# EasyEDA Pro project GPU USB PWM Fan Controller.epro

# Schematic Schematic1_1
Board Name: Board1; Create Date: 2026-03-28; Page Name: P1; Project Name: 多路温控控制PWM风扇; Schematic Name: Schematic1; Update Date: 2026-03-28; Company: 嘉立创EDA; Page Size: A4; Version: V1.0
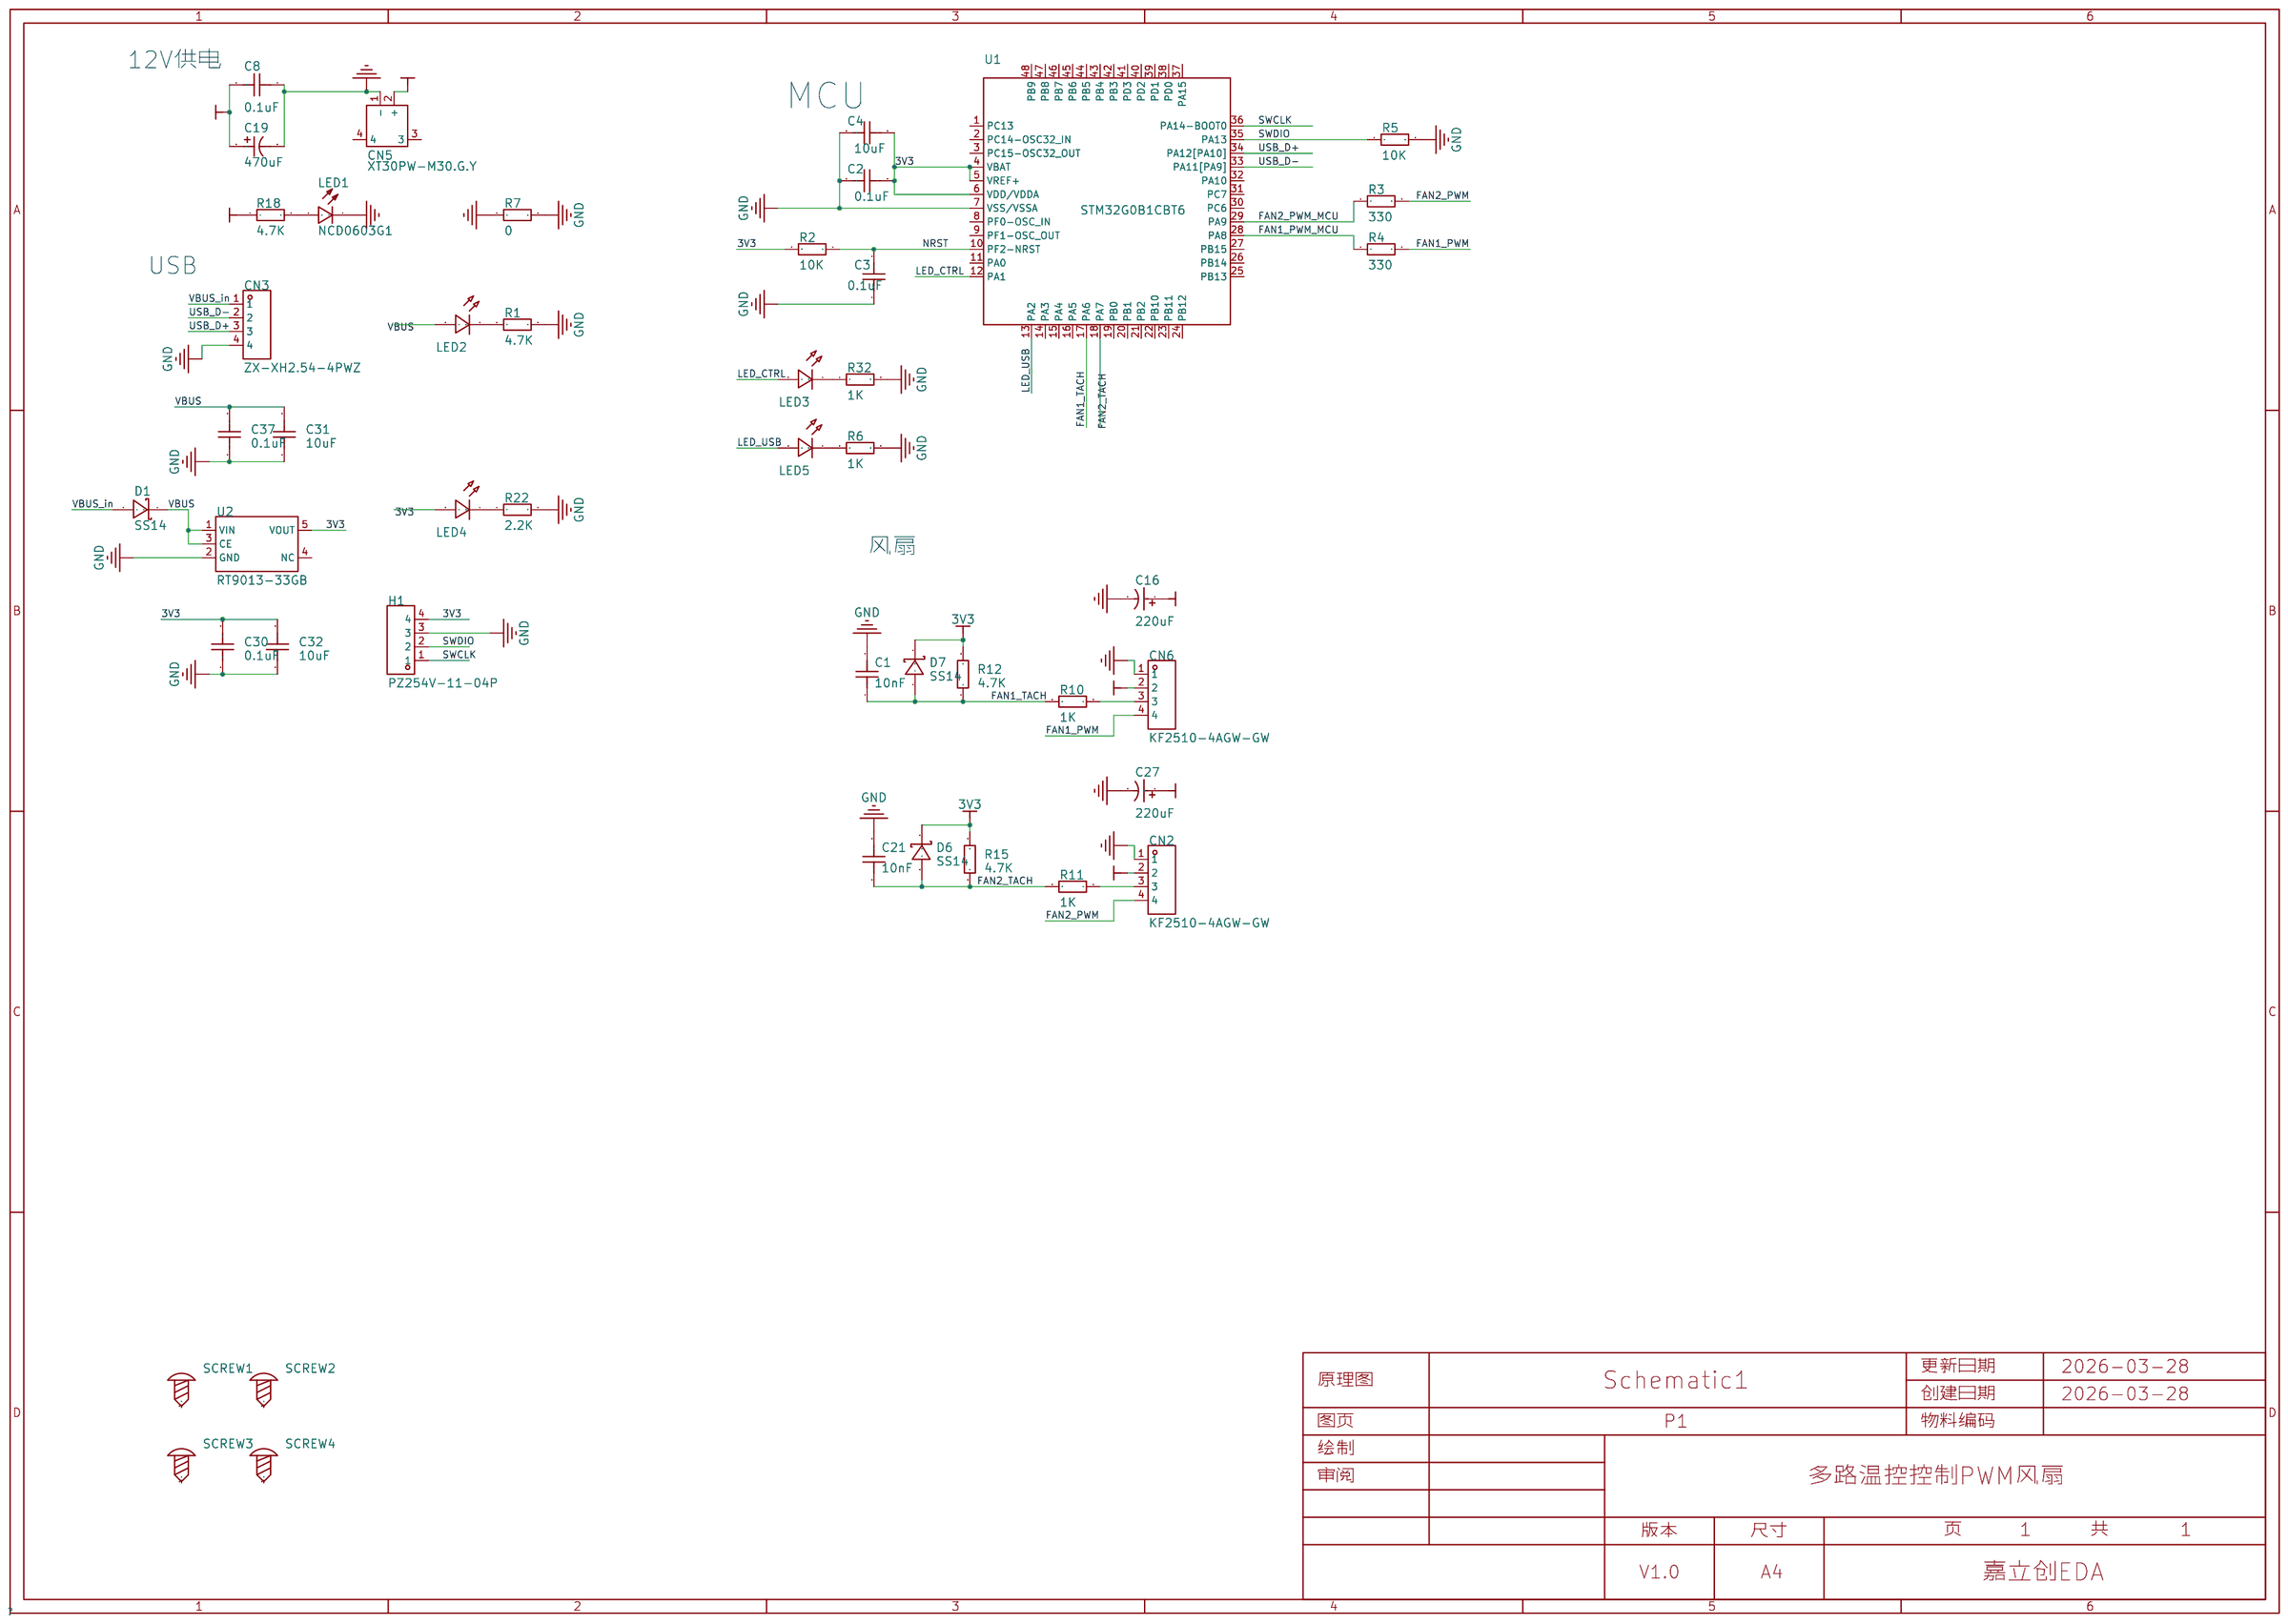
[diagram p0: schematic sheet]

## Parts
C1  10nF  [C0603]
C2  0.1uF  [C0603]
C3  0.1uF  [C0603]
C4  10uF  [C0603]
C8  0.1uF  [C0603]
C16  220uF  [CAP-SMD_BD6.3-L6.6-W6.6-FD]
C19  470uF  [CAP-SMD_BD6.3-L6.6-W6.6-LS7.6-FD]
C21  10nF  [C0603]
C27  220uF  [CAP-SMD_BD6.3-L6.6-W6.6-FD]
C30  0.1uF  [C0603]
C31  10uF  [C0603]
C32  10uF  [C0603]
C37  0.1uF  [C0603]
CN2  KF2510-4AGW-GW  [CONN-TH_4P-P2.54_CAX_KF2510-4AGW-GW]
CN3  ZX-XH2.54-4PWZ  [CONN-TH_4P-P2.50_ZX-XH2.54-4PWZ]
CN5  XT30PW-M30.G.Y  [CONN-TH_XT30PW-M]
CN6  KF2510-4AGW-GW  [CONN-TH_4P-P2.54_CAX_KF2510-4AGW-GW]
D1  SS14  [SMA_L4.3-W2.6-LS5.2-RD]
D6  SS14  [SMA_L4.3-W2.6-LS5.2-RD]
D7  SS14  [SMA_L4.3-W2.6-LS5.2-RD]
H1  PZ254V-11-04P  [HDR-TH_4P-P2.54-V-M]
LED1  NCD0603G1  [LED0603-RD_1]
LED2  -  [LED_0603]
LED3  -  [LED_0603]
LED4  -  [LED_0603]
LED5  -  [LED_0603]
R1  4.7K  [R0603]
R2  10K  [R0603]
R3  330  [R0603]
R4  330  [R0603]
R5  10K  [R0603]
R6  1K  [R0603]
R7  0  [R0603]
R10  1K  [R0603]
R11  1K  [R0603]
R12  4.7K  [R0603]
R15  4.7K  [R0603]
R18  4.7K  [R0603]
R22  2.2K  [R0603]
R32  1K  [R0603]
SCREW1  -  [M3螺丝]
SCREW2  -  [M3螺丝]
SCREW3  -  [M3螺丝]
SCREW4  -  [M3螺丝]
U1  STM32G0B1CBT6  [LQFP-48_L7.0-W7.0-P0.50-LS9.0-BL]
U2  RT9013-33GB  [SOT-23-5_L2.9-W1.6-P0.95-LS2.8-BR]

## Library data of the parts
C1-C4 C8 C21 C30-C32 C37 = CAP_0603: Supplier Footprint: 0603
C16 C27 = RVT1A221M0605_C72494: 容值:220uF;精度:±20%;额定电压:10V;纹波电流:90mA@120Hz;等效串联电阻(ESR):-;; LCSC Part Name: 220uF ±20% 10V; Supplier Part: C72494; Manufacturer: ROQANG(容强); Manufacturer Part: RVT1A221M0605; Supplier Footprint: SMD,D6.3xL5.4mm; JLCPCB Part Class: Extended Part; Datasheet: https://atta.szlcsc.com/upload/public/pdf/source/20170325/1490427950282.pdf; Supplier: LCSC; Tolerance: ±20%; Voltage Rating: 10V; Ripple Current: 90mA@120Hz; Diameter: 6.3mm; Height - Seated (Max): 5.4mm; Lifetime: 2000hrs@105℃; Operating Temperature: -40℃~+105℃
C19 = RVT470UF10V67RV0159: 容值:470uF;精度:±20%;额定电压:10V;等效串联电阻(ESR):-;; LCSC Part Name: 470uF ±20% 10V; Supplier Part: C2858856; Manufacturer: KNSCHA(科尼盛); Supplier Footprint: SMD,D6.3xL7.7mm; JLCPCB Part Class: Extended Part; Datasheet: https://item.szlcsc.com/datasheet/RVT470UF10V67RV0159/3062332.html; Supplier: LCSC; Tolerance: ±20%; Voltage Rating: 10V; Diameter: 6.3mm; Height - Seated (Max): 7.7mm; Lifetime: 2000hrs@105℃; Operating Temperature: -55℃~+105℃
CN2 CN6 = KF2510-4AGW-GW: 插针结构:1x4P;间距:2.54mm;安装方式:弯插;参考系列:-;总PIN数:4P;排数:1;每排PIN数:4;行距:-;额定电流:3A;触头材质:黄铜;工作温度:-25℃~+85℃;; LCSC Part Name: 1x4P 间距:2.54mm 弯插; Supplier Part: C722747; Manufacturer: CAX(创都); Supplier Footprint: 弯插,P=2.54mm; JLCPCB Part Class: Extended Part; Datasheet: https://item.szlcsc.com/datasheet/KF2510-4AGW-GW/766954.html; Supplier: LCSC; Pins Structure: 1x4P; Pitch: 2.54mm; Mounting Type: 弯插; Number of Pins: 4P; Number of Rows: 1; Number of PINs Per Row: 4; Current Rating: 3A; Contact Material: 黄铜; Operating Temperature: -25℃~+85℃; Voltage Rating: 250V; Plastic Material: PA66; Color: 米色; Z-Height of the Board: 5.8mm; X-Length of Bottom Edge on Board (Spacing Line): 10.16mm
CN3 = ZX-XH2.54-4PWZ: 插针结构:1x4P;间距:2.5mm;安装方式:弯插;参考系列:XH;总PIN数:4P;排数:1;每排PIN数:4;行距:-;额定电流:3A;触头材质:黄铜;触头镀层:锡;工作温度:-25℃~+85℃;; LCSC Part Name: 1x4P 间距:2.5mm 弯插 系列:XH; Supplier Part: C7429643; Manufacturer: Megastar(兆星); Supplier Footprint: 弯插,P=2.5mm; JLCPCB Part Class: Extended Part; Datasheet: https://item.szlcsc.com/datasheet/ZX-XH2.54-4PWZ/8427560.html; Supplier: LCSC; Pins Structure: 1x4P; Pitch: 2.5mm; Mounting Type: 弯插; Reference Series: XH; Number of Pins: 4P; Number of Rows: 1; Number of PINs Per Row: 4; Current Rating: 3A; Contact Material: 黄铜; Contact Plating: 锡; Operating Temperature: -25℃~+85℃; Voltage Rating: 250V; Plastic Material: PA66; Flame Retardant Rating: UL94V-0; Color: 白色; Z-Height of the Board: 5.9mm; X-Length of Bottom Edge on Board (Spacing Line): 12.5mm; Y-Width of Bottom Edge on Board: 7.32mm
CN5 = XT30PW-M30.G.Y: Socket,DCsupply,XT30,male,PIN:2; LCSC Part Name: AMASS(艾迈斯)航模插头电调机插座锂电池连接器 PCB板卧式 公头XT30PW-M30.G.Y; Supplier Part: C431092; Manufacturer: AMASS(艾迈斯); JLCPCB Part Class: Extended Part; Datasheet: https://item.szlcsc.com/datasheet/XT30PW-M30.G.Y/426930.html; Supplier: LCSC; Rated current: 15A; Rated voltage: 500VDC; Connector type: 航模插头; Wire gauge: 16/18/20AWG; contact resistance: 1.2mΩ; Size/Specification: 2pin; interface form: 公头
D1 D6 D7 = SS14_C83852: 正向压降(Vf):500mV@1A;直流反向耐压(Vr):40V;整流电流:1A;; LCSC Part Name: 电压:40V 电流:1A; Supplier Part: C83852; Manufacturer: onsemi(安森美); Supplier Footprint: SMA(DO-214AC); JLCPCB Part Class: Extended Part; Datasheet: https://item.szlcsc.com/datasheet/SS14/85019.html; Supplier: LCSC; Voltage - Forward(Vf@If): 500mV@1A; Voltage - DC Reverse(Vr): 40V; Current - Rectified: 1A; Reverse Leakage Current (Ir): 200uA@40V; Operating Junction Temperature Range: -65℃~+125℃; Non-Repetitive Peak Forward Surge Current: 40A
H1 = PZ254V-11-04P: 插针结构:1x4P;间距:2.54mm;行距:-;圆针/方针:方针;安装方式:直插;排数:单排;总PIN位数:4P;额定电流:3A;额定电压:250V;配合针长度:6mm;塑高:2.5mm;端接针长度:3mm;触头材质:-;工作温度:-40℃~+105℃;颜色:黑色;; LCSC Part Name: 1x4P 间距:2.54mm 方针 直插; Supplier Part: C2691448; Manufacturer: XFCN(兴飞); Supplier Footprint: 插件,P=2.54mm; JLCPCB Part Class: Extended Part; Datasheet: https://item.szlcsc.com/datasheet/PZ254V-11-04P/2801085.html; Supplier: LCSC; Pin Structure: 1x4P; Pitch: 2.54mm; Circluar Pins/Square Pins: 方针; Mounting Type: 直插; Number of Rows: 单排; Number of Pins: 4P; Current Rating: 3A; Voltage Rating (Max): 250V; Length of Mating Pin: 6mm; Insulation Height: 2.5mm; Length of End Connection Pin: 3mm; Operating Temperature: -40℃~+105℃; Color: 黑色
LED1 = NCD0603G1: 灯头类型:-;发光颜色:翠绿色;正向压降(Vf):2.6V~3.6V;功率:72mW;正向电流:20mA;波长:515nm~530nm;二极管配置:独立二极管;透镜颜色:-;色温:-;发光强度:900mcd;发光角度:130°;载带方式:-;工作温度:-30℃~+85℃;; LCSC Part Name: 片式发光二极管; Supplier Part: C84267; Manufacturer: 国星光电; Supplier Footprint: 0603; JLCPCB Part Class: Extended Part; Datasheet: https://item.szlcsc.com/datasheet/NCD0603G1/85436.html; Supplier: LCSC; Illumination Color: 翠绿色; Voltage - Forward(Vf): 2.6V~3.6V; Power(Watts): 72mW; Forward Current: 20mA; Wavelength - Dominant: 515nm~530nm; Peak Wavelength: 520nm; Diode Configuration: 独立二极管; Luminous Intensity: 900mcd; Viewing Angle: 130°; Operating Temperature: -30℃~+85℃
LED2-LED5 = LED_0603-R: Supplier Footprint: 0603
R1-R7 R10-R12 R15 R18 R22 R32 = Res_0603: Supplier Footprint: 0603
SCREW1-SCREW4 = M3螺丝: Supplier Footprint: 插件
U1 = STM32G0B1CBT6: CPU内核:ARM-M系列;应用领域:-;; LCSC Part Name: 主流Arm Cortex-M0+ 32位MCU，最高128KB闪存，144KB内存，6个USART，定时器，ADC，DAC，通信接口，1.7-3.6V; Supplier Part: C2847904; Manufacturer: ST(意法半导体); Supplier Footprint: LQFP-48(7x7); JLCPCB Part Class: Extended Part; Datasheet: https://item.szlcsc.com/datasheet/STM32G0B1CBT6/3045330.html; Supplier: LCSC; CPU Core: ARM-M系列
U2 = RT9013-33GB_C19268157: Supplier Part: C19268157; Manufacturer: TECH PUBLIC(台舟); Supplier Footprint: SOT-23-5; JLCPCB Part Class: 扩展库; Datasheet: https://atta.szlcsc.com/upload/public/pdf/source/20231201/9D78CA17020D67EC103F1AC7C29CF260.pdf; Supplier: LCSC

## Nets
3V3: C2.1 C4.1 C30.2 C32.2 D6.1(K) D7.1(K) H1.4 LED4.2(A) R2.2 R12.2 R15.2 U1.4(VBAT) U1.5(VREF+) U1.6(VDD/VDDA) U2.5(VOUT)
12V: C8.2 C16.1 C19.1 C27.1 CN2.2 CN5.2(+) CN6.2 R18.1
GND: C1.2 C2.2 C3.1 C4.2 C21.2 C30.1 C31.1 C32.1 C37.1 CN3.4 H1.3 R1.2 R5.2 R6.2 R7.2 R22.2 R32.2 U1.7(VSS/VSSA) U2.2(GND)
PGND: C8.1 C16.2 C19.2 C27.2 CN2.1 CN5.1(-) CN6.1 LED1.1(K) R7.1
VBUS: C31.2 C37.2 D1.1(K) LED2.2(A) U2.1(VIN) U2.3(CE)
VBUS_in: CN3.1 D1.2(A)
FAN1_PWM: CN6.4 R4.2
FAN1_PWM_MCU: R4.1 U1.28(PA8)
FAN1_TACH: C1.1 D7.2(A) R10.2 R12.1 U1.17(PA6)
FAN2_PWM: CN2.4 R3.2
FAN2_PWM_MCU: R3.1 U1.29(PA9)
FAN2_TACH: C21.1 D6.2(A) R11.2 R15.1 U1.18(PA7)
LED_CTRL: LED3.2(A) U1.12(PA1)
LED_USB: LED5.2(A) U1.13(PA2)
NRST: C3.2 R2.1 U1.10(PF2-NRST)
SWCLK: H1.1 U1.36(PA14-BOOT0)
SWDIO: H1.2 R5.1 U1.35(PA13)
USB_D+: CN3.3 U1.34(PA12[PA10])
USB_D-: CN3.2 U1.33(PA11[PA9])
$1N259: CN6.3 R10.1
$1N269: CN2.3 R11.1
$1N393: LED1.2(A) R18.2
$1N403: LED4.1(C) R22.1
$1N469: LED2.1(C) R1.1
$1N527: LED3.1(C) R32.1
$1N556: LED5.1(C) R6.1

Not connected (* = marked no-connect by the designer): CN5 3 4; SCREW1 1; SCREW2 1; SCREW3 1; SCREW4 1; U1 1(PC13) 2(PC14-OSC32_IN) 3(PC15-OSC32_OUT) 8(PF0-OSC_IN) 9(PF1-OSC_OUT) 11(PA0) 14(PA3) 15(PA4) 16(PA5) 19(PB0) 20(PB1) 21(PB2) 22(PB10) 23(PB11) 24(PB12) 25(PB13) 26(PB14) 27(PB15) 30(PC6) 31(PC7) 32(PA10) 37(PA15) 38(PD0) 39(PD1) 40(PD2) 41(PD3) 42(PB3) 43(PB4) 44(PB5) 45(PB6) 46(PB7) 47(PB8) 48(PB9); U2 4(NC)

## Notes on the sheet
- 12V供电
- MCU
- USB
- 风扇

# Board PCB1_1
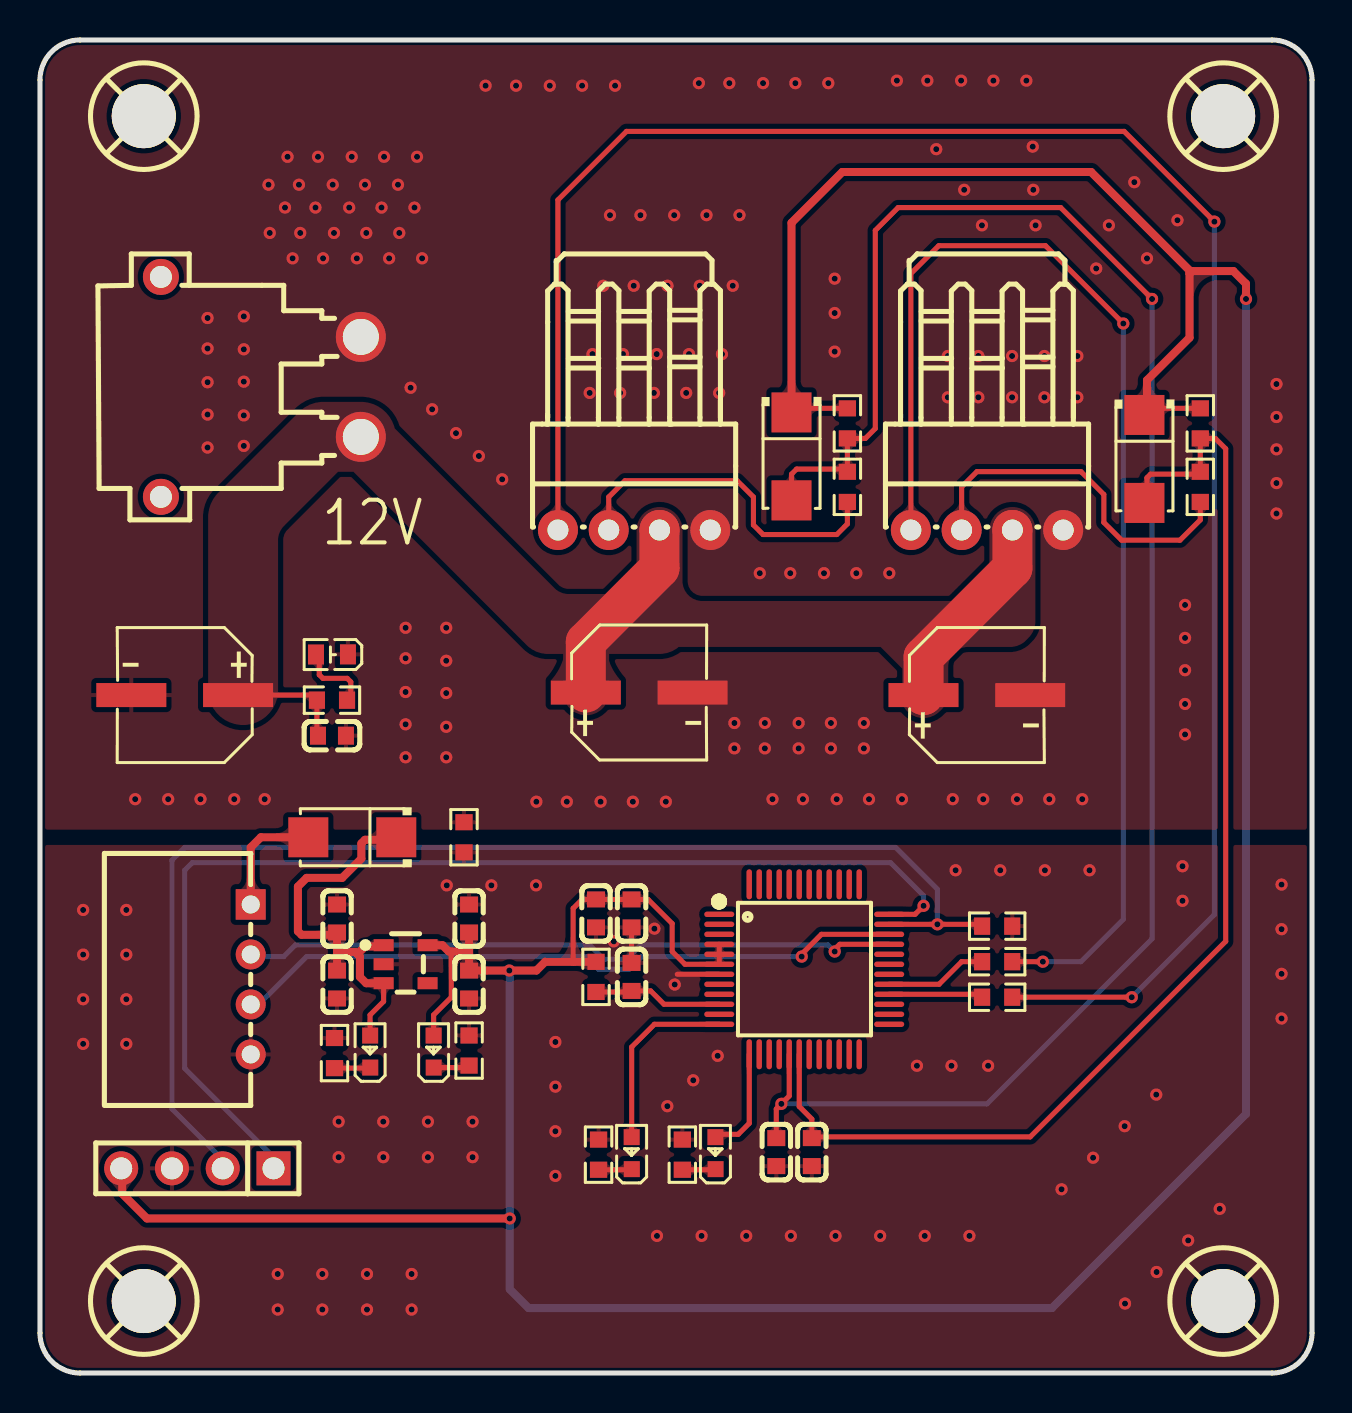
[diagram p1: board, top side]
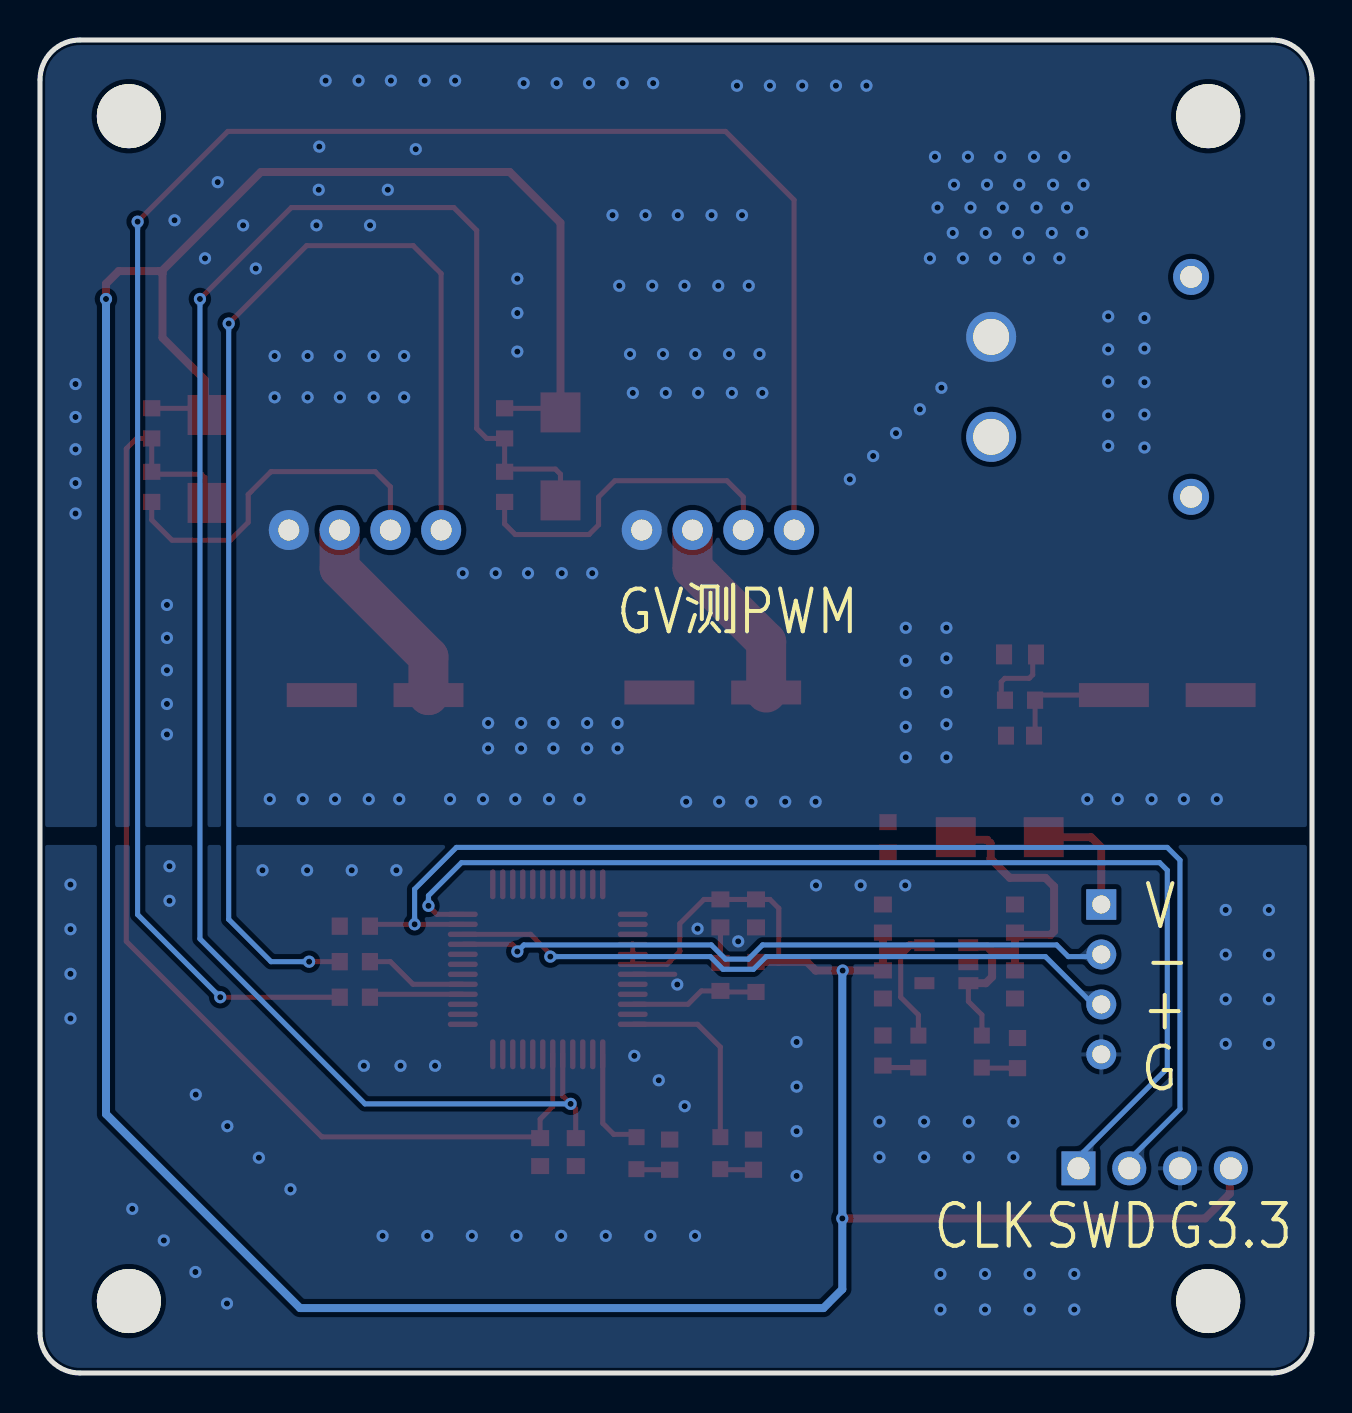
[diagram p2: board, bottom side, seen from below]

Outline 63.63 x 66.67 mm; copper layers: Top Layer, Inner1, Inner2, Bottom Layer. Coordinates in mm from the lower left corner of the outline.
Outline path: 0,64.67 0,2 arc(0.59,0.59) 2,0 61.63,0 arc(63.04,0.59) 63.63,2 63.63,64.67 arc(63.04,66.09) 61.63,66.67 2,66.67 arc(0.59,66.09) 0,64.67
Stack: Top Layer 0.035mm Outer layer thickness 1oz / Dielectric1 0.2104mm 7628 RC49% 8.6mil / Inner1 0.0152mm Inner layer thickness / Dielectric2 1.065mm 1.1mm H/HOZ Copper / Inner2 0.0152mm Inner layer thickness / Dielectric3 0.2104mm 7628 RC49% 8.6mil / Bottom Layer 0.035mm Outer layer thickness 1oz

## Design rules (mm)
spacing copperThickness1oz (default): track to track 0.102, other pairs 0.152 to 0.3
spacing copperThickness2oz: track to track 0.203, other pairs 0.152 to 0.3
track width copperThickness1oz (default): min 0.127, default 0.254, max 2.54
track width copperThickness2oz: min 0.203, default 0.254, max 2.54
differential pair differentialPair (default): width min 0.127, default 0.254, max 2.54; gap min 0.152, default 0.152
net PGND uses copperRegion
net GND uses copperRegion
net 12V uses copperRegion

## Placement (name value [footprint] x y rotation side)
C1  10nF  [C0603]  36.83 11.05 270 top
C2  0.1uF  [C0603]  29.59 22.99 270 top
C3  0.1uF  [C0603]  29.59 19.81 270 top
C4  10uF  [C0603]  27.81 22.99 270 top
C8  0.1uF  [C0603]  14.6 31.88 180 top
C16  220uF  [CAP-SMD_BD6.3-L6.6-W6.6-FD]  46.86 33.91 0 top
C19  470uF  [CAP-SMD_BD6.3-L6.6-W6.6-LS7.6-FD]  7.24 33.91 180 top
C21  10nF  [C0603]  38.61 11.05 270 top
C27  220uF  [CAP-SMD_BD6.3-L6.6-W6.6-FD]  29.97 34.04 0 top
C30  0.1uF  [C0603]  21.46 19.43 90 top
C31  10uF  [C0603]  14.86 19.43 90 top
C32  10uF  [C0603]  21.46 22.73 270 top
C37  0.1uF  [C0603]  14.86 22.73 270 top
CN2  KF2510-4AGW-GW  [CONN-TH_4P-P2.54_CAX_KF2510-4AGW-GW]  47.37 42.16 180 top
CN3  ZX-XH2.54-4PWZ  [CONN-TH_4P-P2.50_ZX-XH2.54-4PWZ]  10.54 19.68 270 top
CN5  XT30PW-M30.G.Y  [CONN-TH_XT30PW-M]  11.05 49.32 270 top
CN6  KF2510-4AGW-GW  [CONN-TH_4P-P2.54_CAX_KF2510-4AGW-GW]  29.72 42.16 180 top
D1  SS14  [SMA_L4.3-W2.6-LS5.2-RD]  15.62 26.8 180 top
D6  SS14  [SMA_L4.3-W2.6-LS5.2-RD]  55.25 45.72 270 top
D7  SS14  [SMA_L4.3-W2.6-LS5.2-RD]  37.59 45.85 270 top
H1  PZ254V-11-04P  [HDR-TH_4P-P2.54-V-M]  7.87 10.24 180 top
LED1  NCD0603G1  [LED0603-RD_1]  14.6 35.94 180 top
LED2  -  [LED_0603]  16.51 16.13 90 top
LED3  -  [LED_0603]  29.59 11.05 90 top
LED4  -  [LED_0603]  19.69 16.13 90 top
LED5  -  [LED_0603]  33.78 11.05 90 top
R1  4.7K  [R0603]  14.73 16 90 top
R2  10K  [R0603]  27.81 19.81 90 top
R3  330  [R0603]  47.88 20.57 0 top
R4  330  [R0603]  47.88 18.8 0 top
R5  10K  [R0603]  47.88 22.35 0 top
R6  1K  [R0603]  32.13 10.92 90 top
R7  0  [R0603]  21.21 26.8 270 top
R10  1K  [R0603]  40.39 44.32 90 top
R11  1K  [R0603]  58.04 44.32 90 top
R12  4.7K  [R0603]  40.39 47.5 90 top
R15  4.7K  [R0603]  58.04 47.5 90 top
R18  4.7K  [R0603]  14.6 33.66 0 top
R22  2.2K  [R0603]  21.46 16.13 90 top
R32  1K  [R0603]  27.94 10.92 90 top
SCREW1  -  [M3螺丝]  5.19 62.86 0 top
SCREW2  -  [M3螺丝]  59.18 62.86 0 top
SCREW3  -  [M3螺丝]  59.18 3.6 0 top
SCREW4  -  [M3螺丝]  5.19 3.6 0 top
U1  STM32G0B1CBT6  [LQFP-48_L7.0-W7.0-P0.50-LS9.0-BL]  38.23 20.19 270 top
U2  RT9013-33GB  [SOT-23-5_L2.9-W1.6-P0.95-LS2.8-BR]  18.29 20.45 180 top

## Footprints (pads in the part's own frame, mm; a bottom-side part is the same pattern mirrored in y, then rotated)
C0603
  rect 0.8x0.9 smd: 1(-0.7,0) 2(0.7,0)
CAP-SMD_BD6.3-L6.6-W6.6-FD
  rect 3.5x1.2 smd: 1(-2.67,0) 2(2.67,0)
CAP-SMD_BD6.3-L6.6-W6.6-LS7.6-FD
  rect 3.5x1.2 smd: 1(-2.67,0) 2(2.67,0)
CONN-TH_4P-P2.50_ZX-XH2.54-4PWZ
  rect 1.524x1.5 hole 0.9: 1(-3.75,0)
  round 1.5 hole 0.9: 2(-1.25,0) 3(1.25,0) 4(3.75,0)
CONN-TH_4P-P2.54_CAX_KF2510-4AGW-GW
  round 2 hole 1.05: 1(-3.81,0) 2(-1.27,0) 3(1.27,0) 4(3.81,0)
CONN-TH_XT30PW-M
  round 2.5 hole 1.8: 1(-2.5,5) 2(2.5,5)
  round 1.8 hole 1.1: 3(5.5,-5) 4(-5.5,-5)
HDR-TH_4P-P2.54-V-M
  rect 1.7x1.7 hole 1.1: 1(-3.81,0)
  round 1.7 hole 1.1: 2(-1.27,0) 3(1.27,0) 4(3.81,0)
LED0603-RD_1
  rect 0.8x1 smd: 1(-0.799,-0.004) 2(0.799,0.004)
LED_0603
  rect 0.8x0.8 smd: 1(-0.851,-0.01) 2(0.75,-0.005)
LQFP-48_L7.0-W7.0-P0.50-LS9.0-BL
  oval 0.27x1.5 smd: 1(-2.75,-4.25) 2(-2.25,-4.25) 3(-1.75,-4.25) 4(-1.25,-4.25) 5(-0.75,-4.25) 6(-0.25,-4.25) 7(0.25,-4.25) 8(0.75,-4.25) 9(1.25,-4.25) 10(1.75,-4.25) 11(2.25,-4.25) 12(2.75,-4.25) 25(2.75,4.25) 26(2.25,4.25) 27(1.75,4.25) 28(1.25,4.25) 29(0.75,4.25) 30(0.25,4.25) 31(-0.25,4.25) 32(-0.75,4.25) 33(-1.25,4.25) 34(-1.75,4.25) 35(-2.25,4.25) 36(-2.75,4.25)
  oval 1.5x0.27 smd: 13(4.25,-2.75) 14(4.25,-2.25) 15(4.25,-1.75) 16(4.25,-1.25) 17(4.25,-0.75) 18(4.25,-0.25) 19(4.25,0.25) 20(4.25,0.75) 21(4.25,1.25) 22(4.25,1.75) 23(4.25,2.25) 24(4.25,2.75) 37(-4.25,2.75) 38(-4.25,2.25) 39(-4.25,1.75) 40(-4.25,1.25) 41(-4.25,0.75) 42(-4.25,0.25) 43(-4.25,-0.25) 44(-4.25,-0.75) 45(-4.25,-1.25) 46(-4.25,-1.75) 47(-4.25,-2.25) 48(-4.25,-2.75)
M3螺丝
  round 3.2 hole 3.2: 1(0,0)
R0603
  rect 0.806x0.864 smd: 1(-0.753,0) 2(0.753,0)
SMA_L4.3-W2.6-LS5.2-RD
  rect 2x2 smd: 1(-2.2,0) 2(2.2,0)
SOT-23-5_L2.9-W1.6-P0.95-LS2.8-BR
  rect 1x0.6 smd: 1(1.1,-0.95) 2(1.1,0) 3(1.1,0.95) 4(-1.1,0.95) 5(-1.1,-0.95)

## Nets
As in the schematic.

Pads without a net: CN5 3 4; SCREW1 1; SCREW2 1; SCREW3 1; SCREW4 1; U1 1 2 3 8 9 11 14 15 16 19 20 21 22 23 24 25 26 27 30 31 32 37 38 39 40 41 42 43 44 45 46 47 48; U2 4

## Via types
v1: diameter 0.61, hole 0.305, Top Layer to Bottom Layer, 233 vias

## Routing (per net, layer and track width the routed paths; a pad name or vN(x,y) marks a point on that pad's centre or on a via; arc(x,y) is an arc through that point)
3V3: length 198
  Top Layer w0.254: 20.57,21.08 20.57,21.07 20.57,18.8 19.69,17.91 LED4.2 ; 26.68,20.57 26.67,20.57 26.67,23.24 27.12,23.69 C2.1 30.41,23.69 31.62,22.48 31.62,21.08 32.26,20.44 U1.6 U1.5 U1.4 ; R12.2 37.8,48.25 D7.1 ; R15.2 55.58,48.25 D6.1
  Top Layer w0.4: v1(60.32,53.72) 60.32,54.48 59.69,55.12 57.63,55.12 57.5,54.99 ; C32.2 C30.2 v1(23.48,20.13) 24.83,20.13 25.26,20.57 R2.2 ; D7.1 37.59,57.53 40.13,60.07 52.58,60.07 57.5,55.15 57.5,54.99 ; 21.34,21.08 20.45,21.08 20.13,21.4 U2.5 ; v1(23.5,7.73) 5.35,7.73 4.11,8.97 4.11,10.54 ; 57.5,54.99 57.5,51.79 55.37,49.66 55.37,48.05
  Bottom Layer w0.4: v1(23.48,20.13) 23.5,20.11 v1(23.5,7.73) 23.5,4.19 24.44,3.25 50.62,3.25 60.32,12.95 v1(60.32,53.72)
12V: length 25.6
  Top Layer w0.254: C8.2 13.85,31.93 R18.1 13.6,33.91 C19.1
  Top Layer w2: C27.1 27.3,36.57 30.99,40.26 CN6.2 ; C16.1 44.2,33.91 44.2,35.81 48.64,40.26 CN2.2
GND: length 3.9
  Top Layer w0.254: C3.1 C2.2 ; U1.7 31.88,19.94
  vias: v1(2.16,23.16) v1(2.16,20.93) v1(2.16,18.7) v1(2.16,16.46) v1(4.32,23.16) v1(4.32,20.93) v1(4.32,18.7) v1(4.32,16.46) v1(11.89,4.95) v1(11.89,3.17) v1(14.12,4.95) v1(14.12,3.17) v1(14.94,12.57) v1(14.94,10.79) v1(16.36,4.95) v1(16.36,3.17) v1(17.17,12.57) v1(17.17,10.79) v1(18.59,4.95) v1(18.59,3.17) v1(19.4,12.57) v1(19.4,10.79) v1(20.35,24.39) v1(21.64,12.57) v1(21.64,10.79) v1(22.58,24.39) v1(24.81,24.39) v1(25.78,16.56) v1(25.78,14.32) v1(25.78,12.09) v1(25.78,9.86) v1(28.7,21.59) v1(30.73,22.22) v1(30.86,6.86) v1(31.38,13.35) v1(31.75,19.43) v1(32.68,14.64) v1(33.09,6.86) v1(33.9,15.86) v1(35.33,6.86) v1(37.56,6.86) v1(39.79,6.86) v1(42.02,6.86) v1(43.87,15.37) v1(44.26,6.86) v1(45.59,15.37) v1(45.8,25.15) v1(46.49,6.86) v1(47.43,15.37) v1(48.03,25.15) v1(50.27,25.15) v1(51.1,9.19) v1(52.5,25.15) v1(52.68,10.77) v1(54.26,12.35) v1(54.27,3.47) v1(55.84,13.92) v1(55.85,5.05) v1(57.15,25.35) v1(57.15,23.62) v1(57.43,6.63) v1(59.01,8.21) v1(62.1,24.43) v1(62.1,22.2) v1(62.1,19.97) v1(62.1,17.73)
PGND:
  vias: v1(4.76,28.7) v1(6.41,28.7) v1(8.03,28.7) v1(8.38,52.77) v1(8.38,51.24) v1(8.38,49.56) v1(8.38,47.94) v1(8.38,46.29) v1(9.72,28.7) v1(10.19,52.85) v1(10.19,51.2) v1(10.19,49.59) v1(10.19,47.9) v1(10.19,46.37) v1(11.24,28.7) v1(11.43,59.44) v1(11.49,57.02) v1(12.26,58.29) v1(12.38,60.83) v1(12.64,55.75) v1(12.95,59.44) v1(13.02,57.02) v1(13.78,58.29) v1(13.91,60.83) v1(14.16,55.75) v1(14.64,59.44) v1(14.71,57.02) v1(15.47,58.29) v1(15.59,60.83) v1(15.85,55.75) v1(16.26,59.44) v1(16.32,57.02) v1(17.08,58.29) v1(17.21,60.83) v1(17.46,55.75) v1(17.91,59.44) v1(17.97,57.02) v1(18.29,37.27) v1(18.29,35.75) v1(18.29,34.06) v1(18.29,32.45) v1(18.29,30.8) v1(18.54,49.28) v1(18.73,58.29) v1(18.86,60.83) v1(19.11,55.75) v1(19.62,48.2) v1(20.32,37.27) v1(20.32,35.63) v1(20.32,34.01) v1(20.32,32.32) v1(20.32,30.8) v1(20.81,47.01) v1(21.95,45.87) v1(22.29,64.39) v1(23.12,44.7) v1(23.81,64.39) v1(24.83,28.57) v1(25.5,64.39) v1(26.35,28.57) v1(27.12,64.39) v1(27.5,49.02) v1(27.64,50.96) v1(28.04,28.57) v1(28.17,54.38) v1(28.51,57.91) v1(28.77,64.39) v1(29.02,49.02) v1(29.16,50.96) v1(29.7,54.38) v1(29.66,28.57) v1(30.04,57.91) v1(30.71,49.02) v1(30.85,50.96) v1(31.31,28.57) v1(31.39,54.38) v1(31.72,57.91) v1(32.32,49.02) v1(32.46,50.96) v1(32.96,64.52) v1(33,54.38) v1(33.34,57.91) v1(33.97,49.02) v1(34.11,50.96) v1(34.48,64.52) v1(34.65,54.38) v1(34.73,32.51) v1(34.73,31.24) v1(34.99,57.91) v1(36,40) v1(36.17,64.52) v1(36.26,32.51) v1(36.26,31.24) v1(36.64,28.7) v1(37.53,40) v1(37.78,64.52) v1(37.95,32.51) v1(37.95,31.24) v1(38.16,28.7) v1(39.22,40) v1(39.43,64.52) v1(39.56,32.51) v1(39.56,31.24) v1(39.75,54.74) v1(39.75,53.02) v1(39.75,51.09) v1(39.85,28.7) v1(40.83,40) v1(41.21,32.51) v1(41.21,31.24) v1(41.47,28.7) v1(42.48,40) v1(42.86,64.64) v1(43.12,28.7) v1(44.39,64.64) v1(44.83,61.21) v1(45.41,50.87) v1(45.41,48.8) v1(45.66,28.7) v1(46.07,64.64) v1(46.23,59.18) v1(46.94,50.87) v1(46.94,48.8) v1(47.12,57.4) v1(47.18,28.7) v1(47.69,64.64) v1(48.62,50.87) v1(48.62,48.8) v1(48.87,28.7) v1(49.34,64.64) v1(49.66,61.34) v1(49.68,59.18) v1(49.8,57.4) v1(50.24,50.87) v1(50.24,48.8) v1(50.48,28.7) v1(51.89,50.87) v1(51.89,48.8) v1(52.13,28.7) v1(52.83,55.24) v1(53.47,57.4) v1(54.74,59.56) v1(55.37,55.75) v1(56.9,57.66) v1(57.28,38.42) v1(57.28,36.77) v1(57.28,35.15) v1(57.28,33.46) v1(57.28,31.94) v1(61.85,49.47) v1(61.85,47.82) v1(61.85,46.2) v1(61.85,44.51) v1(61.85,42.99)
VBUS: length 20.6
  Top Layer w0.254: LED2.2 16.51,16.88 16.51,17.91 17.19,18.58 U2.3
  Top Layer w0.4: D1.1 17.69,26.67 16.26,26.67 16.08,26.49 16.08,25.73 15.11,24.77 13.34,24.77 12.9,24.33 12.9,22.1 13.08,21.92 14.74,21.92 C37.2 14.86,21.06 ; 14.86,21.06 C31.2 ; 14.86,21.06 15.77,21.06 15.89,20.94 ; U2.1 17.13,21.34 16.26,21.34 15.89,20.97 15.89,20.94 ; 15.89,20.94 16,20.83 16,19.81 16.32,19.5 U2.3
VBUS_IN: length 3.6
  Top Layer w0.4: 11.05,26.8 10.54,26.29 10.54,23.43
VBUS_in: length 2
  Top Layer w0.4: 11.05,26.8 13.08,26.8
FAN1_PWM: length 99.1
  Top Layer w0.254: v1(58.74,57.59) 54.23,62.1 29.34,62.1 25.91,58.67 CN6.4 ; v1(54.61,18.8) R4.2
  Bottom Layer w0.254: v1(54.61,18.8) 58.74,22.93 v1(58.74,57.59)
FAN1_PWM_MCU: length 4.7
  Top Layer w0.254: R4.1 46.98,18.94 U1.28
FAN1_TACH: length 92.1
  Top Layer w0.254: D7.2 37.59,44.96 37.85,45.21 40.25,45.21 R10.2 R12.1 41.28,46.74 41.78,47.24 41.78,57.15 42.93,58.29 51.05,58.29 v1(55.63,53.72) ; C1.1 36.83,13.21 v1(37.08,13.46) 37.48,13.85 U1.17
  Bottom Layer w0.254: v1(37.08,13.46) 47.37,13.46 55.63,21.72 v1(55.63,53.72)
FAN2_PWM: length 61.9
  Top Layer w0.254: v1(50.16,20.57) R3.2 ; v1(54.19,52.49) 50.29,56.39 44.96,56.39 43.56,54.99 CN2.4
  Bottom Layer w0.254: v1(50.16,20.57) 52.07,20.57 54.19,22.69 v1(54.19,52.49)
FAN2_PWM_MCU: length 5.1
  Top Layer w0.254: R3.1 46.1,20.57 44.97,19.44 U1.29
FAN2_TACH: length 61
  Top Layer w0.254: D6.2 55.37,43.65 55.37,44.78 55.55,44.96 57.92,44.96 R11.2 R15.1 58.79,46.74 59.31,46.23 59.31,21.59 49.53,11.81 38.61,11.81 38.61,12.7 37.98,13.33 U1.18
LED_CTRL: length 9.4
  Top Layer w0.254: U1.12 30.73,17.44 29.6,16.3 LED3.2
LED_USB: length 5.4
  Top Layer w0.254: U1.13 35.48,12.49 34.92,11.94 33.93,11.94 LED5.2
NRST: length 6.5
  Top Layer w0.254: R2.1 29.54,19.06 C3.2 30.54,19.11 31.21,18.44 U1.10
SWCLK: length 57
  Top Layer w0.254: U1.36 43.77,22.94 v1(44.2,23.37)
  Bottom Layer w0.254: H1.1 11.43,10.49 11.43,11.05 7.24,15.24 7.24,25.15 7.62,25.53 42.54,25.53 44.2,23.88 v1(44.2,23.37)
SWDIO: length 62.3
  Top Layer w0.254: R5.1 47.03,22.44 v1(44.89,22.44) U1.35
  Bottom Layer w0.254: v1(44.89,22.44) 44.89,24.2 42.8,26.29 7.24,26.29 6.6,25.65 6.6,13.21 9.14,10.67 H1.2
USB_D+: length 34
  Top Layer w0.254: v1(38.1,20.83) 38.1,20.95 39.09,21.94 U1.34
  Bottom Layer w0.254: v1(38.1,20.83) 30.1,20.83 29.46,20.19 27.94,20.19 27.31,20.83 13.34,20.83 10.94,18.43 CN3.3
USB_D-: length 33.2
  Top Layer w0.254: v1(39.75,21.08) 39.75,21.19 40,21.44 U1.33
  Bottom Layer w0.254: CN3.2 10.65,20.83 12.19,20.83 12.78,21.41 27.48,21.41 28.19,20.7 29.34,20.7 30.05,21.41 39.42,21.41 v1(39.75,21.08)
$1N259: length 17.2
  Top Layer w0.254: R10.1 40.39,42.47 39.85,41.94 36.17,41.94 35.69,42.42 35.69,43.81 34.87,44.63 29.26,44.63 28.45,43.81 CN6.3
$1N269: length 18
  Top Layer w0.254: R11.1 58.04,42.67 57.02,41.66 54.1,41.66 53.21,42.55 53.21,43.94 52.07,45.08 46.86,45.08 46.1,44.32 CN2.3
$1N393: length 3.8
  Top Layer w0.254: R18.2 15.55,33.84 15.55,34.57 15.37,34.75 14.15,34.75 13.97,34.92 13.97,35.77 LED1.2
$1N403: length 1.8
  Top Layer w0.254: LED4.1 21.43,15.28 21.46,15.25
$1N469: length 1.8
  Top Layer w0.254: R1.1 16.49,15.25 LED2.1
$1N527: length 1.7
  Top Layer w0.254: R32.1 29.57,10.17 LED3.1
$1N556: length 1.7
  Top Layer w0.254: LED5.1 33.76,10.17 R6.1

## Copper pours and planes (outline as drawn; the poured copper is in the pictures)
12V on Top Layer: 43.09,33.57 43.13,34.35 43.13,35.23 42.04,36.31 31.95,36.31 31.5,36.06 30.99,35.96 28.47,35.96 28.47,34.05 28.13,33.24 27.32,32.9 26.5,33.24 26.17,34.05 26.17,35.96 25.41,35.96 24.83,36.08 24.35,36.4 15.68,45.07 14.91,45.07 12.2,42.37 11.99,42.04 11.91,41.66 11.91,34.16 11.4,32.92 10.16,32.41 8.92,32.92 8.41,34.16 8.41,42.8 8.54,43.47 8.92,44.04 12.95,48.06 13.52,48.44 14.19,48.57 16.05,48.57 17.13,48.2 17.75,47.25 25.74,39.26 26.06,39.04 26.44,38.96 28.84,38.96 29.55,39.26 29.84,39.96 29.84,42.16 30.17,42.98 30.99,43.31 31.8,42.98 32.14,42.16 32.14,39.61 32.43,38.91 33.14,38.61 46.49,38.61 47.2,38.91 47.49,39.61 47.49,42.16 47.83,42.98 48.64,43.31 49.45,42.98 49.79,42.16 49.79,37.59 49.7,37.15 49.45,36.78 49.33,36.65 48.95,36.4 48.51,36.31 46.43,36.31 45.72,36.02 45.43,35.31 45.43,34 45.34,33.56 45.09,33.18 45.01,33.1 44.31,32.76 43.56,32.95
GND on Top Layer: -0.64,26.42 63.88,26.42 63.88,-1.4 -0.64,-1.4
GND on Bottom Layer: -4.7,26.42 66.67,26.42 66.67,-0.89 -4.7,-0.89
PGND on Top Layer: -0.64,69.47 65.41,69.47 65.41,27.18 -0.64,27.18
PGND on Bottom Layer: -7.75,67.56 68.71,67.56 68.71,27.3 -7.75,27.3

Small or netless copper shapes (teardrops, artwork), in the pictures only: 112 on Top Layer, 18 on Bottom Layer

## Text on the board
Bottom Silkscreen Layer: 3.3 | G | V | - | + | SWD | CLK | GV测PWM
Top Silkscreen Layer: 12V
